# Altium project Laird RG191-M2 LoRa Concentrator Daughterboard.PrjPcb
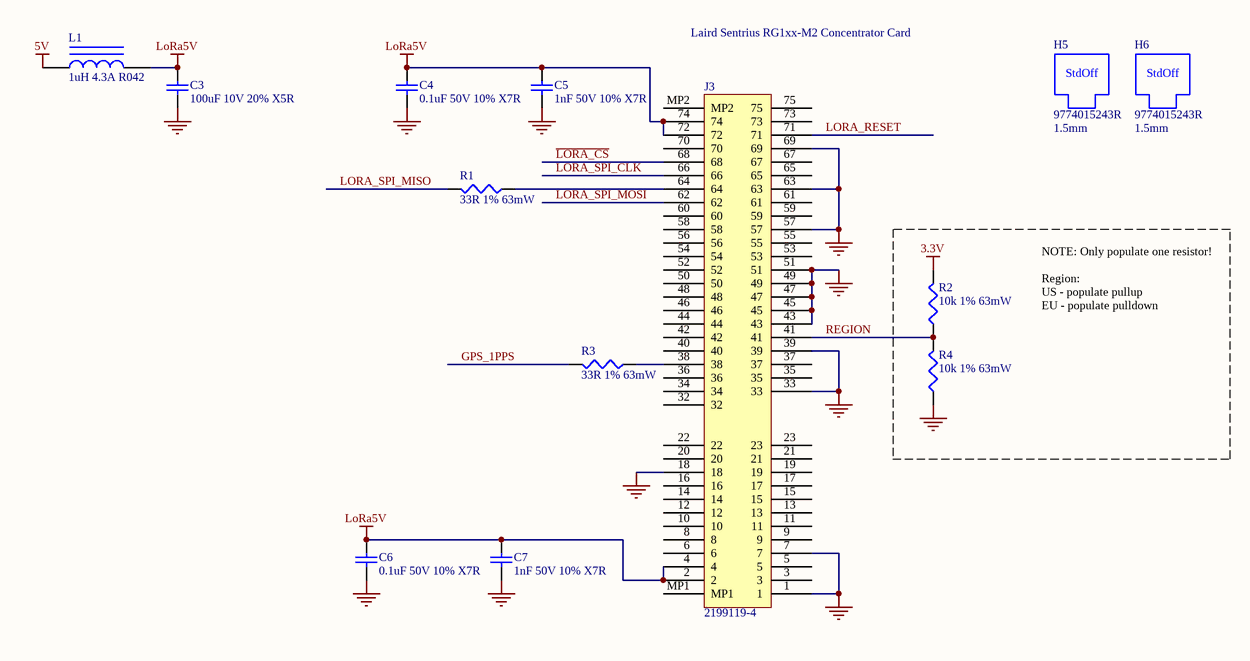
[diagram p0: RG191-M2 Header.SchDoc]
2 sheets, 24 parts. Net scope: global (net labels, ports and power ports of the same name join across sheets).
Board file: Laird RG191-M2 LoRa Concentrator Daughterboard.PcbDoc
Sheets:
  RG191-M2 Header.SchDoc
  Motherboard Connectors and Memory.SchDoc

## Sheet RG191-M2 Header.SchDoc: Laird RG191-M2 LoRa Concentrator Daughterboard
size Letter; DrawnBy: MTAN; Organization: Altium Limited; DocumentNumber: 1; Revision: A; SheetNumber: 1; SheetTotal: 2

### Parts
C3  100uF 10V 20% X5R  [C1210_L]
C4  0.1uF 50V 10% X7R  [CAPC1005L]
C5  1nF 50V 10% X7R  [CAPC1005L]
C6  0.1uF 50V 10% X7R  [CAPC1005L]
C7  1nF 50V 10% X7R  [CAPC1005L]
H5  9774015243R  Height: 1.5mm  [Wurth 9774015243R]
H6  9774015243R  Height: 1.5mm  [Wurth 9774015243R]
J3  2199119-4  [TE 2199119-4]
L1  1uH 4.3A R042  [WE-LQS 252012]
R1  33R 1% 63mW  [RESC1005L]
R2  10k 1% 63mW  [RESC1005L]
R3  33R 1% 63mW  [RESC1005L]
R4  10k 1% 63mW  [RESC1005L]

### Nets
3.3V: R2.2
5V: L1.1
GND: C3.1 C4.2 C5.2 C6.2 C7.2 J3.1 J3.7 J3.18 J3.33 J3.39 J3.43 J3.45 J3.47 J3.49 J3.51 J3.57 J3.63 J3.69 R4.1
LoRa5V: C3.2 C4.1 C5.1 C6.1 C7.1 J3.2 J3.4 J3.72 J3.74 L1.2
GPS_1PPS: R3.2
~{LORA_CS}: J3.68
LORA_RESET: J3.71
LORA_SPI_CLK: J3.66
LORA_SPI_MISO: R1.2
LORA_SPI_MOSI: J3.62
REGION: J3.41 R2.1 R4.2
NetJ3_38: J3.38 R3.1
NetJ3_64: J3.64 R1.1

Not connected (* = marked no-connect by the designer): J3 3 5 6 8 9 10 11 12 13 14 15 16 17 19 20 21 22 23 32 34 35 36 37 40 42 44 46 48 50 52 53 54 55 56 58 59 60 61 65 67 70 73 75 MP1 MP2

### Notes on the sheet
- Laird Sentrius RG1xx-M2 Concentrator Card
- NOTE: Only populate one resistor!
  Region:
  US - populate pullup
  EU - populate pulldown
- Title
- Drawn By:
- Date:
- Time:
- Revision:
- Sheet
- of
- The Latium Group of Companies
- 1312 10 Street
- Nisku, Alberta
- T9E 8K2
- Canada
- File:
- (in symbol SMD 1.5mm Spacer) StdOff

### Library data of the parts
C3-C7 = Cap: Capacitor
  C3: Value: 100uF 10V 20% X5R
  C4 C6: Value: 0.1uF 50V 10% X7R
  C5 C7: Value: 1nF 50V 10% X7R
H5 H6 = SMD 1.5mm Spacer: RND STANDOFF M2X0.4 STEEL; Manufacturer: Wurth Electronics Inc; Supplier 1: Digi-Key; Value: 9774015243R; Manufacturer Part Number: 9774015243R; Supplier 1 Part Number: 732-7069-1-ND; ComponentLink1Description: Drawing; ComponentLink1URL: S:\Hardware\Data Sheets\Passive\Standoffs\Wurth 9774015243R.pdf
J3 = TE2199119-4: CONN FEMALE 67POS 0.020 GOLD; Manufacturer: TE Connectivity AMP Connectors; Value: 2199119-4; Manufacturer Part Number: 2199119-4; ComponentLink1Description: Data Sheet; ComponentLink1URL: S:\Hardware\Data Sheets\Passive\Connectors\TE NGFF M2 Connector.pdf; Supplier 1: Digi-Key; Supplier 1 Part Number: A115900CT-ND
L1 = Inductor Iron: FIXED IND 1UH 4.3A 42 MOHM SMD; Manufacturer Part Number: DFE252012P-1R0M=P2; Manufacturer: Murata Electronics; Value: 1uH 4.3A R042; Supplier 1: Digi-Key; Supplier 1 Part Number: 490-10647-1-ND
R1-R4 = Res3: Resistor
  R1 R3: Value: 33R 1% 63mW
  R2 R4: Value: 10k 1% 63mW

## Sheet Motherboard Connectors and Memory.SchDoc: Laird RG191-M2 LoRa Concentrator Daughterboard
size Letter; DrawnBy: MTAN; Organization: Altium Limited; DocumentNumber: 2; Revision: A; SheetNumber: 2; SheetTotal: 2
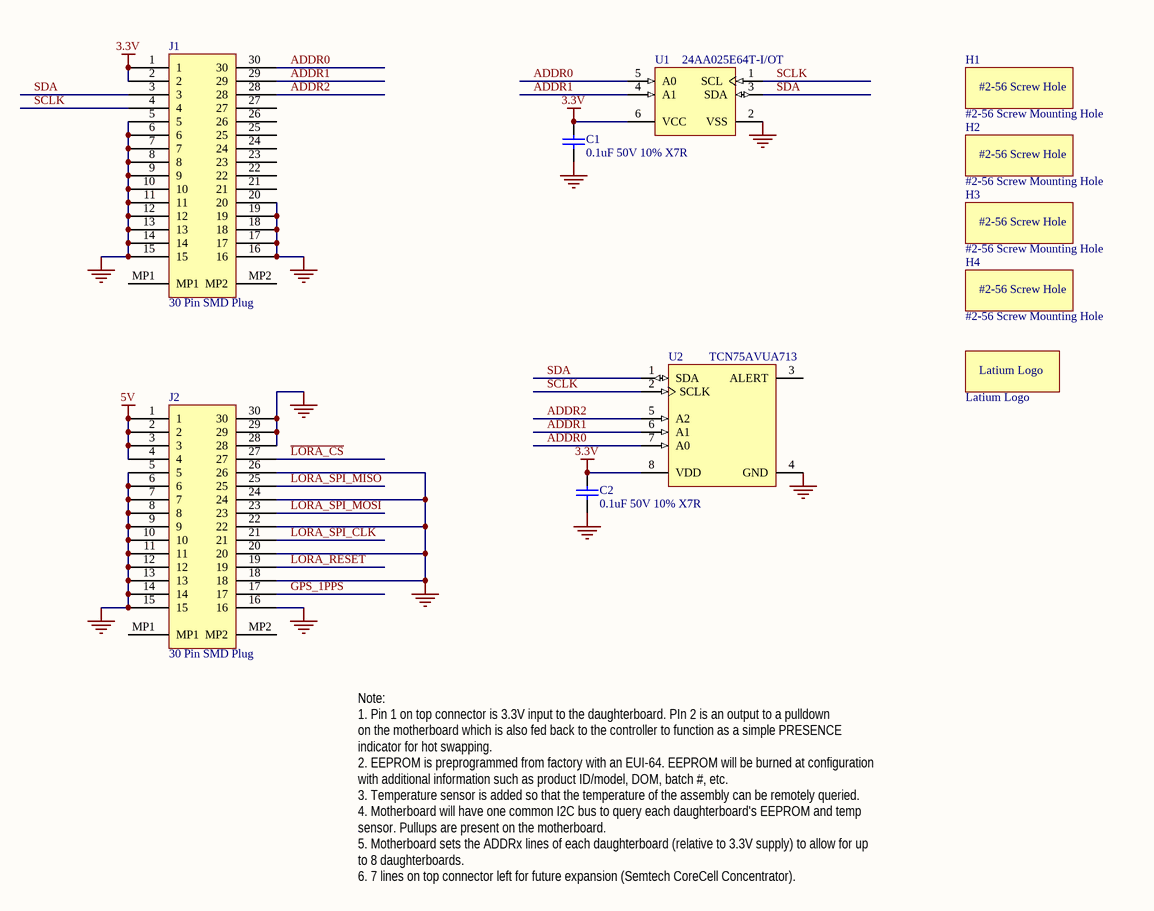
[diagram p1: Motherboard Connectors and Memory.SchDoc]

### Parts
C1  0.1uF 50V 10% X7R  [CAPC1005L]
C2  0.1uF 50V 10% X7R  [CAPC1005L]
H1  #2-56 Screw Mounting Hole  [2-56 Screw Mount]  (no BOM)
H2  #2-56 Screw Mounting Hole  [2-56 Screw Mount]  (no BOM)
H3  #2-56 Screw Mounting Hole  [2-56 Screw Mount]  (no BOM)
H4  #2-56 Screw Mounting Hole  [2-56 Screw Mount]  (no BOM)
H7  Latium Logo  [LatiumLogo]  (no BOM)
J1  30 Pin SMD Plug  [10132797-031100LF]
J2  30 Pin SMD Plug  [10132797-031100LF]
U1  24AA025E64T-I/OT  [MCHP-SOT-23-OT6_L]
U2  TCN75AVUA713  [MSOP-UA8_L]

### Nets
3.3V: C1.1 C2.1 J1.1 J1.2 U1.6(VCC) U2.8(VDD)
5V: J2.1 J2.2 J2.3 J2.4
GND: C1.2 C2.2 J1.5 J1.6 J1.7 J1.8 J1.9 J1.10 J1.11 J1.12 J1.13 J1.14 J1.15 J1.16 J1.17 J1.18 J1.19 J1.20 J2.5 J2.6 J2.7 J2.8 J2.9 J2.10 J2.11 J2.12 J2.13 J2.14 J2.15 J2.16 J2.18 J2.20 J2.22 J2.24 J2.26 J2.28 J2.29 J2.30 U1.2(VSS) U2.4(GND)
ADDR0: J1.30 U1.5(A0) U2.7(A0)
ADDR1: J1.29 U1.4(A1) U2.6(A1)
ADDR2: J1.28 U2.5(A2)
GPS_1PPS: J2.17
~{LORA_CS}: J2.27
LORA_RESET: J2.19
LORA_SPI_CLK: J2.21
LORA_SPI_MISO: J2.25
LORA_SPI_MOSI: J2.23
SCLK: J1.4 U1.1(SCL) U2.2(SCLK)
SDA: J1.3 U1.3(SDA) U2.1(SDA)

Not connected (* = marked no-connect by the designer): J1 21 22 23 24 25 26 27 MP1 MP2; J2 MP1 MP2; U2 3(ALERT)

### Notes on the sheet
- Note:
  1. Pin 1 on top connector is 3.3V input to the daughterboard. PIn 2 is an output to a pulldown
  on the motherboard which is also fed back to the controller to function as a simple PRESENCE
  indicator for hot swapping.
  2. EEPROM is preprogrammed from factory with an EUI-64. EEPROM will be burned at configuration
  with additional information such as product ID/model, DOM, batch #, etc.
  3. Temperature sensor is added so that the temperature of the assembly can be remotely queried.
  4. Motherboard will have one common I2C bus to query each daughterboard's EEPROM and temp
  sensor. Pullups are present on the motherboard.
  5. Motherboard sets the ADDRx lines of each daughterboard (relative to 3.3V supply) to allow for up
  to 8 daughterboards.
  6. 7 lines on top connector left for future expansion (Semtech CoreCell Concentrator).
- Title
- Drawn By:
- Date:
- Time:
- Revision:
- Sheet
- of
- The Latium Group of Companies
- 1312 10 Street
- Nisku, Alberta
- T9E 8K2
- Canada
- File:
- (in symbol #2-56 Screw Support) #2-56 Screw Hole

### Library data of the parts
C1 C2 = Cap: Capacitor; Value: 0.1uF 50V 10% X7R
H1-H4 = #2-56 Screw Support: Value: #2-56 Screw Mounting Hole
J1 J2 = Amphenol 30 Pos BergStak Plug: CONN PLUG 30POS SMD GOLD; Manufacturer: Amphenol ICC (FCI); Note: Mates with 10132798-031100LF receptacle 3mm between board height; Value: 30 Pin SMD Plug; Manufacturer Part Number: 10132797-031100LF; Supplier 1: Digi-Key; Supplier 1 Part Number: 609-5024-1-ND
U1 = 24AA025E64T-I/OT: IC EEPROM 2K I2C 400KHZ SOT23-6; Manufacturer: Microchip Technology; Value: 24AA025E64T-I/OT; Manufacturer Part Number: 24AA025E64T-I/OT; Supplier 1: Digi-Key; Supplier 1 Part Number: 24AA025E64T-I/OTCT-ND
U2 = TCN75AVUA713: SENSOR DIGITAL -40C-125C 8MSOP; Manufacturer: Microchip Technology; Value: TCN75AVUA713; Manufacturer Part Number: TCN75AVUA713; Supplier 1: Digi-Key; Supplier 1 Part Number: TCN75AVUA713CT-ND
H7 = Latium Logo: Value: Latium Logo

## Nets that join several sheets
3.3V: RG191-M2 Header (R2.2), Motherboard Connectors and Memory (6 pins)
5V: RG191-M2 Header (L1.1), Motherboard Connectors and Memory (J2.1 J2.2 J2.3 J2.4)
GND: RG191-M2 Header (19 pins), Motherboard Connectors and Memory (40 pins)
GPS_1PPS: RG191-M2 Header (R3.2), Motherboard Connectors and Memory (J2.17)
~{LORA_CS}: RG191-M2 Header (J3.68), Motherboard Connectors and Memory (J2.27)
LORA_RESET: RG191-M2 Header (J3.71), Motherboard Connectors and Memory (J2.19)
LORA_SPI_CLK: RG191-M2 Header (J3.66), Motherboard Connectors and Memory (J2.21)
LORA_SPI_MISO: RG191-M2 Header (R1.2), Motherboard Connectors and Memory (J2.25)
LORA_SPI_MOSI: RG191-M2 Header (J3.62), Motherboard Connectors and Memory (J2.23)